# Altium schematic sheet _dragonboard.SchDoc
size Tabloid
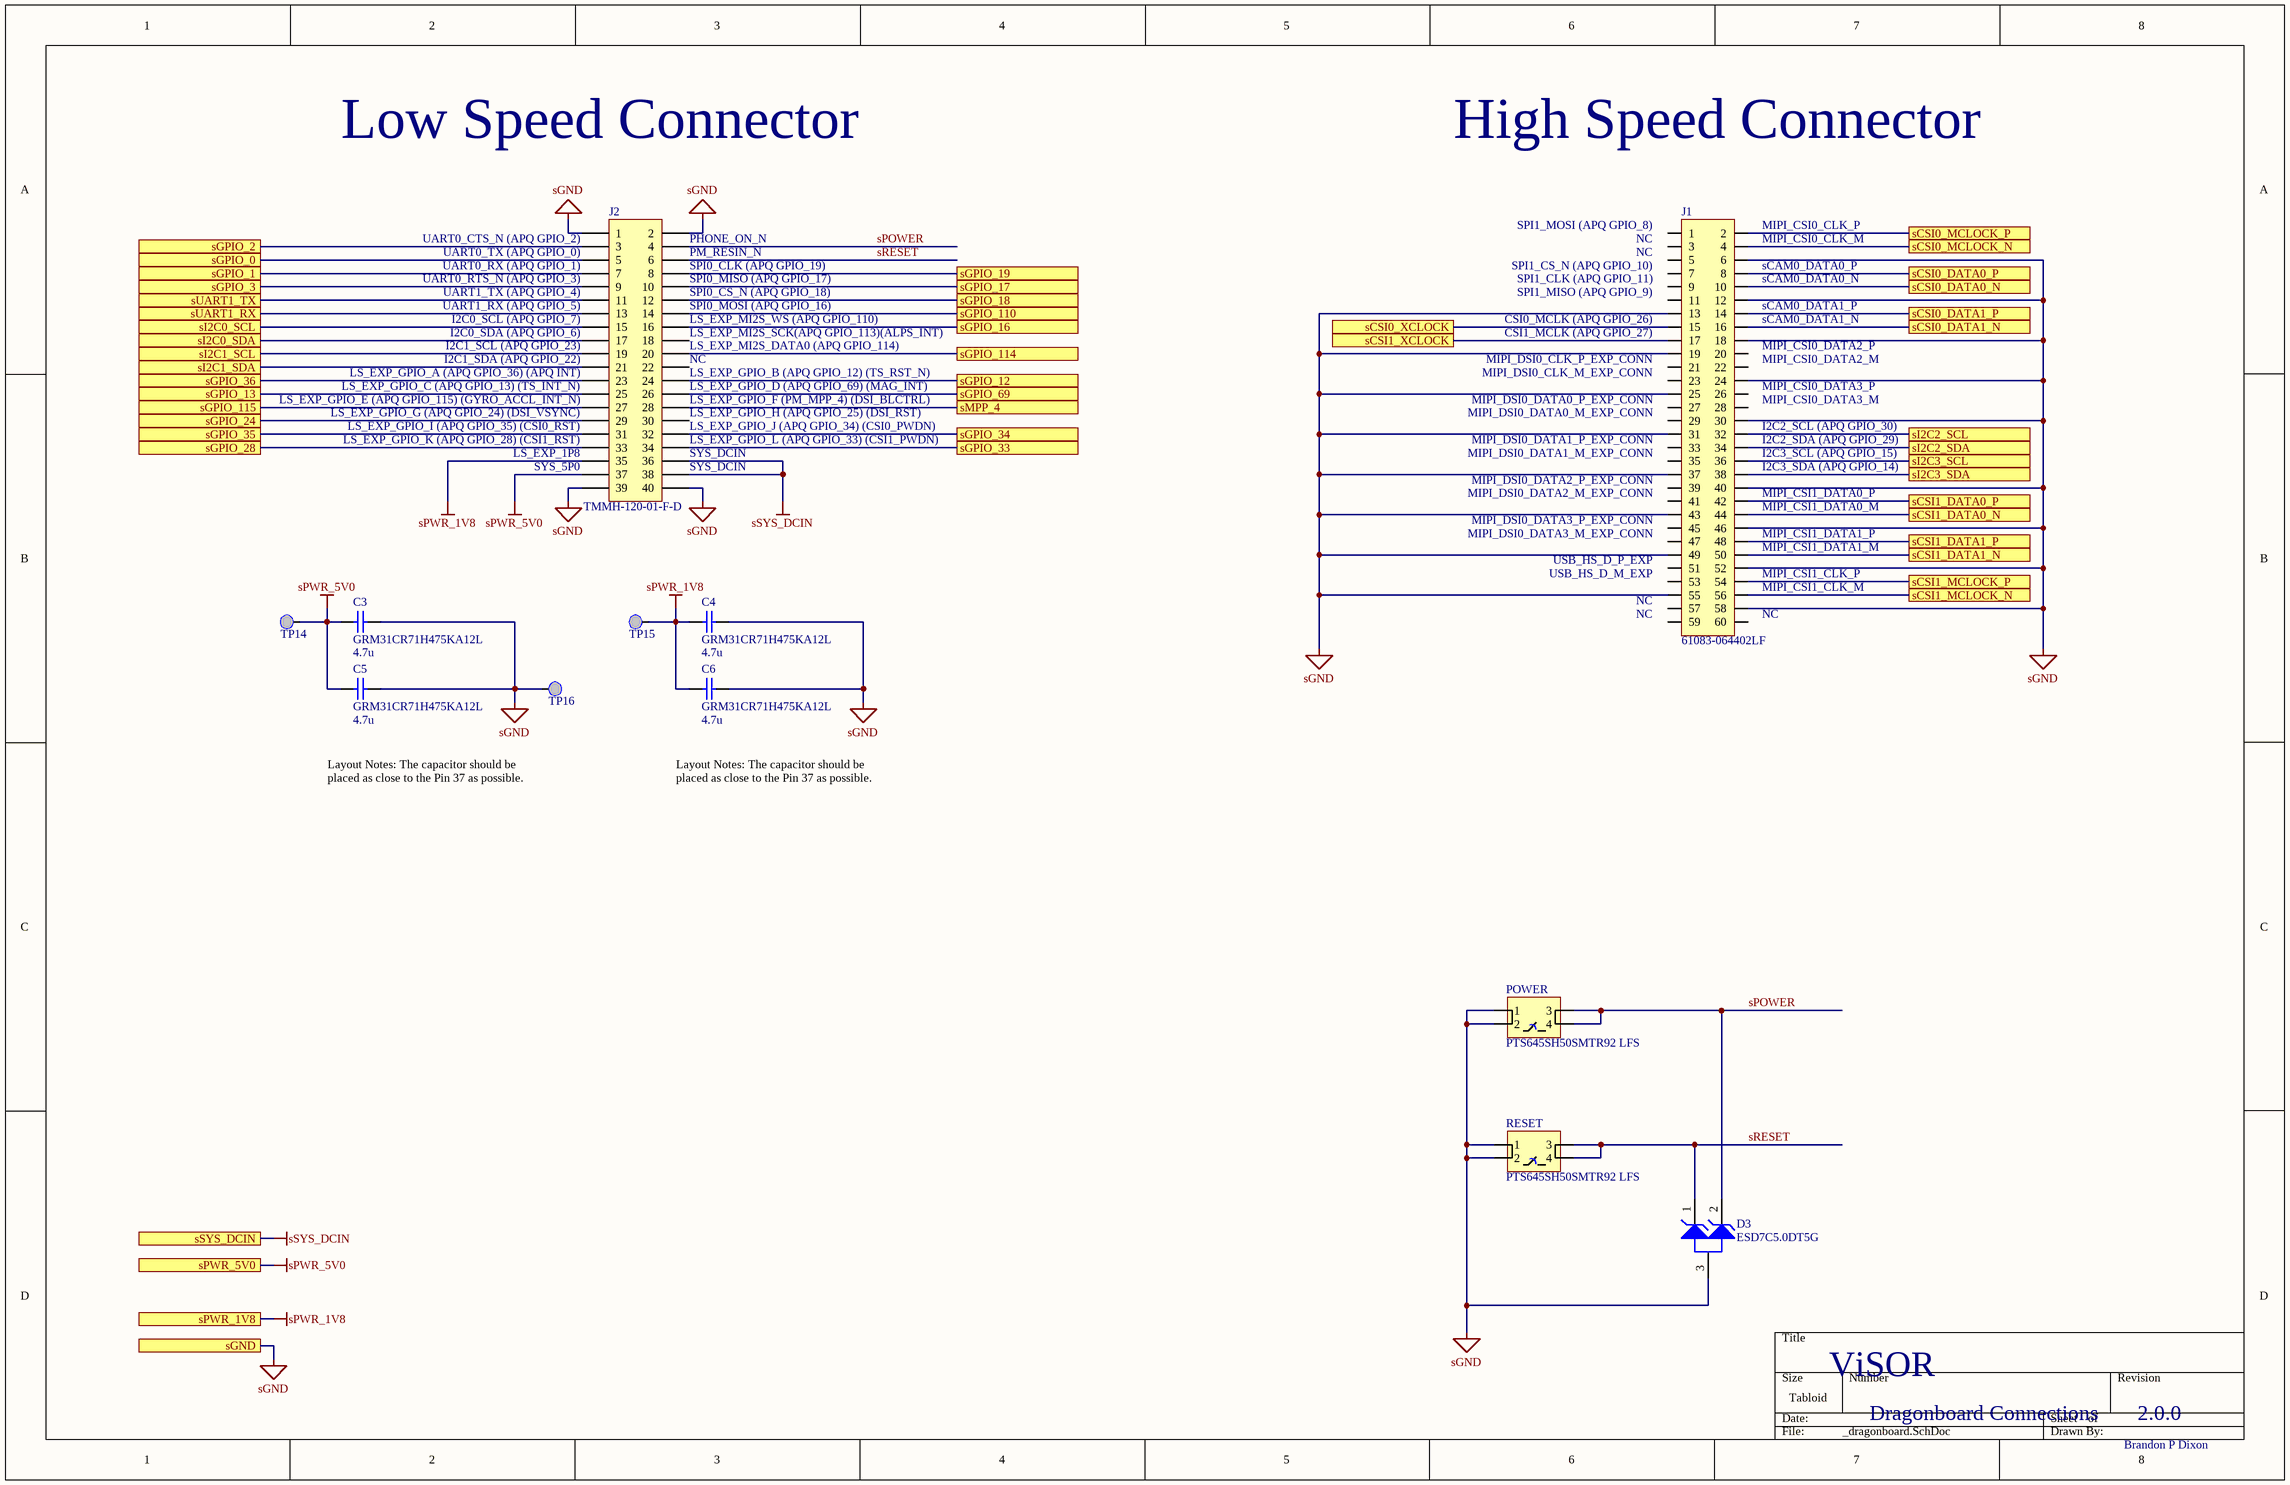
[diagram p0: _dragonboard.SchDoc]

## Parts
C3  GRM31CR71H475KA12L  value 4.7u  [1206]
C4  GRM31CR71H475KA12L  value 4.7u  [1206]
C5  GRM31CR71H475KA12L  value 4.7u  [1206]
C6  GRM31CR71H475KA12L  value 4.7u  [1206]
D3  ESD7C5.0DT5G  [ONSC-SOT-723-3-631AA-01_V]
J1  61083-064402LF  [61083-064402LF]
J2  TMMH-120-01-F-D  [HDR2X20.Metric]
POWER  PTS645SH50SMTR92 LFS  [PTS645SH50SMTR92 LFS]
RESET  PTS645SH50SMTR92 LFS  [PTS645SH50SMTR92 LFS]
TP14  TP  [TP_TH]  (value not drawn)
TP15  TP  [TP_TH]  (value not drawn)
TP16  TP  [TP_TH]  (value not drawn)

## Ports
sCSI0_DATA0_N, sCSI0_DATA0_P, sCSI0_DATA1_N, sCSI0_DATA1_P, sCSI0_MCLOCK_N, sCSI0_MCLOCK_P, sCSI0_XCLOCK, sCSI1_DATA0_N, sCSI1_DATA0_P, sCSI1_DATA1_N, sCSI1_DATA1_P, sCSI1_MCLOCK_N, sCSI1_MCLOCK_P, sCSI1_XCLOCK, sGND, sGPIO_0, sGPIO_1, sGPIO_2, sGPIO_3, sGPIO_12, sGPIO_13, sGPIO_16, sGPIO_17, sGPIO_18, sGPIO_19, sGPIO_24, sGPIO_28, sGPIO_33, sGPIO_34, sGPIO_35, sGPIO_36, sGPIO_69, sGPIO_110, sGPIO_114, sGPIO_115, sI2C0_SCL, sI2C0_SDA, sI2C1_SCL, sI2C1_SDA, sI2C2_SCL, sI2C2_SDA, sI2C3_SCL, sI2C3_SDA, sMPP_4, sPWR_1V8, sPWR_5V0, sSYS_DCIN, sUART1_RX, sUART1_TX

## Nets
sGND: C3.1 C4.1 C5.1 C6.1 D3.3(A) J1.6 J1.12 J1.13 J1.18 J1.19 J1.24 J1.25 J1.30 J1.31 J1.37 J1.40 J1.43 J1.46 J1.49 J1.52 J1.55 J1.58 J2.1 J2.2 J2.39 J2.40 POWER.1 POWER.2 RESET.1 RESET.2 TP16.1 ; port sGND
sPWR_1V8: C4.2 C6.2 J2.35 TP15.1 ; port sPWR_1V8
sPWR_5V0: C3.2 C5.2 J2.37 TP14.1 ; port sPWR_5V0
sSYS_DCIN: J2.36 J2.38 ; port sSYS_DCIN
sCSI0_DATA0_N: J1.10 ; port sCSI0_DATA0_N
sCSI0_DATA0_P: J1.8 ; port sCSI0_DATA0_P
sCSI0_DATA1_N: J1.16 ; port sCSI0_DATA1_N
sCSI0_DATA1_P: J1.14 ; port sCSI0_DATA1_P
sCSI0_MCLOCK_N: J1.4 ; port sCSI0_MCLOCK_N
sCSI0_MCLOCK_P: J1.2 ; port sCSI0_MCLOCK_P
sCSI0_XCLOCK: J1.15 ; port sCSI0_XCLOCK
sCSI1_DATA0_N: J1.44 ; port sCSI1_DATA0_N
sCSI1_DATA0_P: J1.42 ; port sCSI1_DATA0_P
sCSI1_DATA1_N: J1.50 ; port sCSI1_DATA1_N
sCSI1_DATA1_P: J1.48 ; port sCSI1_DATA1_P
sCSI1_MCLOCK_N: J1.56 ; port sCSI1_MCLOCK_N
sCSI1_MCLOCK_P: J1.54 ; port sCSI1_MCLOCK_P
sCSI1_XCLOCK: J1.17 ; port sCSI1_XCLOCK
sGPIO_0: J2.5 ; port sGPIO_0
sGPIO_1: J2.7 ; port sGPIO_1
sGPIO_2: J2.3 ; port sGPIO_2
sGPIO_3: J2.9 ; port sGPIO_3
sGPIO_12: J2.24 ; port sGPIO_12
sGPIO_13: J2.25 ; port sGPIO_13
sGPIO_16: J2.16 ; port sGPIO_16
sGPIO_17: J2.10 ; port sGPIO_17
sGPIO_18: J2.12 ; port sGPIO_18
sGPIO_19: J2.8 ; port sGPIO_19
sGPIO_24: J2.29 ; port sGPIO_24
sGPIO_28: J2.33 ; port sGPIO_28
sGPIO_33: J2.34 ; port sGPIO_33
sGPIO_34: J2.32 ; port sGPIO_34
sGPIO_35: J2.31 ; port sGPIO_35
sGPIO_36: J2.23 ; port sGPIO_36
sGPIO_69: J2.26 ; port sGPIO_69
sGPIO_110: J2.14 ; port sGPIO_110
sGPIO_114: J2.20 ; port sGPIO_114
sGPIO_115: J2.27 ; port sGPIO_115
sI2C0_SCL: J2.15 ; port sI2C0_SCL
sI2C0_SDA: J2.17 ; port sI2C0_SDA
sI2C1_SCL: J2.19 ; port sI2C1_SCL
sI2C1_SDA: J2.21 ; port sI2C1_SDA
sI2C2_SCL: J1.32 ; port sI2C2_SCL
sI2C2_SDA: J1.34 ; port sI2C2_SDA
sI2C3_SCL: J1.36 ; port sI2C3_SCL
sI2C3_SDA: J1.38 ; port sI2C3_SDA
sMPP_4: J2.28 ; port sMPP_4
sPOWER: D3.2(K2) J2.4 POWER.3 POWER.4
sRESET: D3.1(K1) J2.6 RESET.3 RESET.4
sUART1_RX: J2.13 ; port sUART1_RX
sUART1_TX: J2.11 ; port sUART1_TX

Not connected (* = marked no-connect by the designer): J1 1 3 5 7 9 11 20 21 22 23 26 27 28 29 33 35 39 41 45 47 51 53 57 59 60; J2 18 22 30

## Notes on the sheet
- Low Speed Connector
- High Speed Connector
- (near J1) SPI1_MOSI (APQ GPIO_8)
- (near J1) MIPI_CSI0_CLK_P
- (near J2) UART0_TX (APQ GPIO_0)
- (near J2) UART0_RX (APQ GPIO_1)
- (near J2) UART0_CTS_N (APQ GPIO_2)
- (near J2) UART1_TX (APQ GPIO_4)
- (near J2) UART0_RTS_N (APQ GPIO_3)
- (near J2) PM_RESIN_N
- (near J2) SPI0_CLK (APQ GPIO_19)
- (near J2) PHONE_ON_N
- (near J2) SPI0_CS_N (APQ GPIO_18)
- (near J2) SPI0_MISO (APQ GPIO_17)
- (near J1) SPI1_CLK (APQ GPIO_11)
- (near J1) SPI1_MISO (APQ GPIO_9)
- (near J1) NC
- (near J1) SPI1_CS_N (APQ GPIO_10)
- (near J1) sCAM0_DATA0_P
- (near J1) sCAM0_DATA0_N
- (near J1) MIPI_CSI0_CLK_M
- (near J2) UART1_RX (APQ GPIO_5)
- (near J2) I2C0_SDA (APQ GPIO_6)
- (near J2) I2C1_SCL (APQ GPIO_23)
- (near J2) I2C0_SCL (APQ GPIO_7)
- (near J2) I2C1_SDA (APQ GPIO_22)
- (near J2) SPI0_MOSI (APQ GPIO_16)
- (near J2) LS_EXP_MI2S_SCK(APQ GPIO_113)(ALPS_INT)
- (near J2) LS_EXP_MI2S_DATA0 (APQ GPIO_114)
- (near J2) LS_EXP_MI2S_WS (APQ GPIO_110)
- (near J2) NC
- (near J1) CSI1_MCLK (APQ GPIO_27)
- (near J1) CSI0_MCLK (APQ GPIO_26)
- (near J1) MIPI_DSI0_CLK_P_EXP_CONN
- (near J1) sCAM0_DATA1_P
- (near J1) sCAM0_DATA1_N
- (near J1) MIPI_CSI0_DATA2_P
- (near J1) MIPI_CSI0_DATA2_M
- (near J2) LS_EXP_GPIO_A (APQ GPIO_36) (APQ INT)
- (near J2) LS_EXP_GPIO_C (APQ GPIO_13) (TS_INT_N)
- (near J2) LS_EXP_GPIO_G (APQ GPIO_24) (DSI_VSYNC)
- (near J2) LS_EXP_GPIO_I (APQ GPIO_35) (CSI0_RST)
- (near J2) LS_EXP_GPIO_E (APQ GPIO_115) (GYRO_ACCL_INT_N)
- (near J2) LS_EXP_GPIO_B (APQ GPIO_12) (TS_RST_N)
- (near J2) LS_EXP_GPIO_D (APQ GPIO_69) (MAG_INT)
- (near J2) LS_EXP_GPIO_H (APQ GPIO_25) (DSI_RST)
- (near J2) LS_EXP_GPIO_J (APQ GPIO_34) (CSI0_PWDN)
- (near J2) LS_EXP_GPIO_F (PM_MPP_4) (DSI_BLCTRL)
- (near J1) MIPI_DSI0_DATA0_M_EXP_CONN
- (near J1) MIPI_DSI0_CLK_M_EXP_CONN
- (near J1) MIPI_DSI0_DATA0_P_EXP_CONN
- (near J1) MIPI_CSI0_DATA3_P
- (near J1) MIPI_CSI0_DATA3_M
- (near J1) I2C2_SCL (APQ GPIO_30)
- (near J2) LS_EXP_GPIO_K (APQ GPIO_28) (CSI1_RST)
- (near J2) LS_EXP_1P8
- (near J2) SYS_5P0
- (near J2) LS_EXP_GPIO_L (APQ GPIO_33) (CSI1_PWDN)
- (near J2) SYS_DCIN
- (near J1) MIPI_DSI0_DATA2_P_EXP_CONN
- (near J1) MIPI_DSI0_DATA1_P_EXP_CONN
- (near J1) MIPI_DSI0_DATA1_M_EXP_CONN
- (near J1) MIPI_DSI0_DATA2_M_EXP_CONN
- (near J1) I2C2_SDA (APQ GPIO_29)
- (near J1) I2C3_SCL (APQ GPIO_15)
- (near J1) I2C3_SDA (APQ GPIO_14)
- (near J1) MIPI_CSI1_DATA0_P
- (near J1) MIPI_DSI0_DATA3_P_EXP_CONN
- (near J1) USB_HS_D_P_EXP
- (near J1) MIPI_DSI0_DATA3_M_EXP_CONN
- (near J1) MIPI_CSI1_DATA0_M
- (near J1) MIPI_CSI1_DATA1_P
- (near J1) MIPI_CSI1_DATA1_M
- (near J1) USB_HS_D_M_EXP
- (near J1) MIPI_CSI1_CLK_P
- (near J1) MIPI_CSI1_CLK_M
- Layout Notes: The capacitor should be placed as close to the Pin 37 as possible.
- ViSOR
- Dragonboard Connections
- 2.0.0
- Brandon P Dixon

## Library data of the parts
C3-C6 = GRM31CR71HxxxKdddd: -55-125C, 3216, 50V, X7R, ±10%
D3 = CMP-1063-00208-1: Transient Voltage Suppressor, Micro-Packaged Diode for ESD Protection, 3-Pin SOT-723, Pb-Free, Tape and Reel; Manufacturer: On Semiconductor; C Max (pF): 6.2; Direction: Unidirectional; IR Max (uA): 0.5; V(BR) Min (V): 11; Number of Lines: 2; VRWM Max (V): 5; ComponentLink2Description: Datasheet; PackageVersion: Rev. D, 08/2009; PackageDescription: 3-Pin Small Outline Transistor, Body 1.2 x 0.8 mm, Pitch 0.4 mm; ComponentLink1URL: http://www.onsemi.com/; ComponentLink1Description: Manufacturer URL; RoHS: Pb-Free; DatasheetVersion: Rev. 3; Mounting Technology: Surface Mount; ComponentLink3URL: http://www.onsemi.com/pub_link/Collateral/631AA.PDF; Packing: Tape and Reel; ComponentLink2URL: http://www.onsemi.cn/pub_link/Collateral/ESD7C3.3D-D.PDF; PackageReference: SOT-723-3-631AA-01; ComponentLink3Description: Package Specification; PartNumber: ESD7C5.0DT5G
J2 = TMMH-120-01-F-D: Header, 2x20-Pin, Dual row, Metric
POWER RESET = PTS645SH50SMTR92 LFS: Tactile Switch
J1 = 61083-064402LF: Supplier 1: Mouser; Supplier Part Number 1: 649-61083-064402LF